# Altium schematic sheet ADR1399_BURN-IN_TOOL.SchDoc
size A4; SheetNumber: 1; SheetTotal: 1
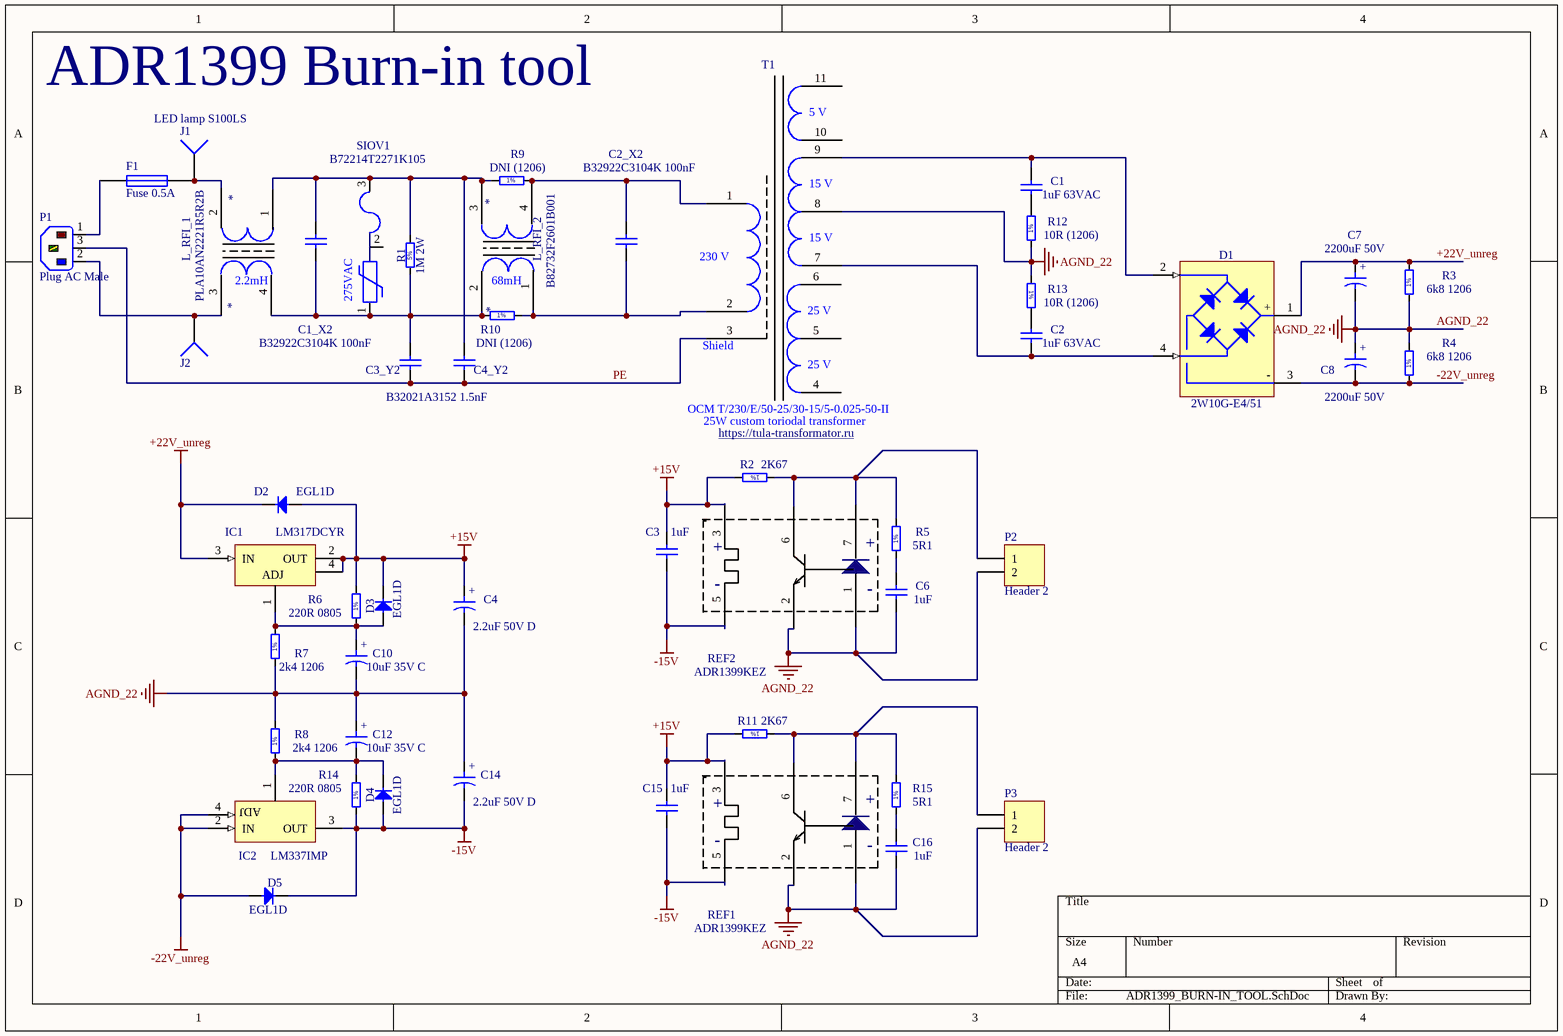
[diagram p0: ADR1399_BURN-IN_TOOL.SchDoc]

## Parts
C1  1uF 63VAC  [B32522C1105]
C1_X2  B32922C3104K 100nF  [B32922D3334K]
C2  1uF 63VAC  [B32522C1105]
C2_X2  B32922C3104K 100nF  [B32922D3334K]
C3  1uF  [C0805(2013)]
C3_Y2  B32021A3152 1.5nF  [B32021A3152]
C4  2.2uF 50V D  [CAPMP7343X310N]
C4_Y2  B32021A3152 1.5nF  [B32021A3152]  (value not drawn)
C6  1uF  [C0805(2013)]
C7  2200uF 50V  [CAPPR750-1850X3750]
C8  2200uF 50V  [CAPPR750-1850X3750]
C10  10uF 35V C  [CAPMP6032X280N]
C12  10uF 35V C  [CAPMP6032X280N]
C14  2.2uF 50V D  [CAPMP7343X310N]
C15  1uF  [C0805(2013)]
C16  1uF  [C0805(2013)]
D1  2W10G-E4/51  [VISHAY_WOG]
D2  EGL1D  [DIOMELF3515N]
D3  EGL1D  [DIOMELF3515N]
D4  EGL1D  [DIOMELF3515N]
D5  EGL1D  [DIOMELF3515N]
F1  Fuse 0.5A  [FUSE]
IC1  LM317DCYR  [SOT230P700X180-4N]
IC2  LM337IMP  [SOT230P700X180-4N]
J1  Socket  [PIN1]  (value not drawn)
J2  Socket  [PIN1]  (value not drawn)
L_RFI_1  PLA10AN2221R5R2B  [PLA10AN2221R5R2B]
L_RFI_2  B82732F2601B001  [B82732F]
P1  Plug AC Male  [AS-205]
P2  Header 2  [HDR1X2]
P3  Header 2  [HDR1X2]
R1  1M 2W  [RES_TYCO_CFR200]
R2  2K67  [R0603-1%]
R3  6k8 1206  [RESC3216X65N]
R4  6k8 1206  [RESC3216X65N]
R5  5R1  [R0603-1%]
R6  220R 0805  [RESC2012X60N]
R7  2k4 1206  [RESC3216X65N]
R8  2k4 1206  [RESC3216X65N]
R9  DNI (1206)  [RESC3216X65N]
R10  DNI (1206)  [RESC3216X65N]
R11  2K67  [R0603-1%]
R12  10R (1206)  [RESC3216X65N]
R13  10R (1206)  [RESC3216X65N]
R14  220R 0805  [RESC2012X60N]
R15  5R1  [R0603-1%]
REF1  ADR1399KEZ  [LCC-8 socket]
REF2  ADR1399KEZ  [LCC-8 socket]
SIOV1  B72214T2271K105  [B72214T2271K105]
T1  OCM T/230/E/50-25/30-15/5-0.025-50-II  [OCM T/230/E/50-25/30-15/5-0.025-50-II]  (value not drawn)

## Nets
+15V: C3.2 C4.1 C15.2 D2.2(A) D3.1(C) IC1.2(OUT) IC1.4(OUT) R2.2 R6.2 R11.2 REF1.3 REF2.3
+22V_unreg: C7.1 D1.1(+) D2.1(C) IC1.3(IN) R3.2
-15V: C3.1 C14.2 C15.1 D4.2(A) D5.1(C) IC2.3(OUT) R14.1 REF1.5 REF2.5
-22V_unreg: C8.2 D1.3(-) D5.2(A) IC2.2(IN) IC2.4(IN) R4.1
AGND_22: C4.2 C6.1 C7.2 C8.1 C10.2 C12.1 C14.1 C16.1 P2.2 P3.2 R3.1 R4.2 R7.1 R8.2 R12.1 R13.1 REF1.1 REF1.2 REF2.1 REF2.2 T1.8
PE: C3_Y2.1 C4_Y2.1 P1.3(E) T1.3
NetC1_1: C1.1 R12.2
NetC1_2: C1.2 D1.2(AC) T1.9
NetC1_X2_1: C1_X2.1 C3_Y2.2 L_RFI_1.4 L_RFI_2.2 R1.1 R10.1 SIOV1.1
NetC1_X2_2: C1_X2.2 C4_Y2.2 L_RFI_1.1 L_RFI_2.3 R1.2 R9.1 SIOV1.3
NetC2_1: C2.1 D1.4(AC) T1.7
NetC2_2: C2.2 R13.2
NetC2_X2_1: C2_X2.1 L_RFI_2.1 R10.2 T1.2
NetC2_X2_2: C2_X2.2 L_RFI_2.4 R9.2 T1.1
NetC6_2: C6.2 R5.1
NetC10_1: C10.1 D3.2(A) IC1.1(ADJ) R6.1 R7.2
NetC12_2: C12.2 D4.1(C) IC2.1(ADJ) R8.1 R14.2
NetC16_2: C16.2 R15.1
NetF1_1: F1.1 P1.1(L)
NetF1_2: F1.2 J1.1 L_RFI_1.2
NetJ2_1: J2.1 L_RFI_1.3 P1.2(N)
NetP2_1: P2.1 R2.1 R5.2 REF2.6 REF2.7
NetP3_1: P3.1 R11.1 R15.2 REF1.6 REF1.7

Not connected (* = marked no-connect by the designer): SIOV1 2; T1 4 5 6 10(5) 11

## Notes on the sheet
- ADR1399 Burn-in tool
- (near J1) LED lamp S100LS
- (near L_RFI_1) 2.2mH
- (near SIOV1) 275VAC
- (near L_RFI_2) 68mH
- (in symbol ADR1399KEZ) +; -
- (in symbol CAER_10000UF_16V_20%_CHEMI-CON_EKYB160ELL103MMP1S) +
- (in symbol CTE6032-28_10UF_25V_10%_LESR0500) +
- (in symbol CTE7343-31_22UF_35V_20%_LESR0400) +
- (in symbol OCM T/230/E/50-25/30-15/5-0.025-50-II) 5 V; 15 V; 230 V; 25 V; Shield; 25W custom toriodal transformer; https://tula-transformator.ru
- (in symbol R0805_220R_1%_0.125W_100PPM) 1%
- (in symbol R1206_2K4_1%_0.25W_100PPM) 1%
- (in symbol R1206_5R6_1%_0.25W_200PPM) 1%
- (in symbol RCF_NO-VALUE_5%_2W_0-450PPM_TYCO_CFR200) 5%

## Library data of the parts
C1 C2 = CPPR_330NF_630V_5%_2250-1050X2650X1650: Non-polarised capacitor; Part Description: Metallized Polypropylene Film Capacitor (MKP); Manufacturer: TDK; Manufacturer Part Number: B32653A6334J000; Voltage: 630VDC/250VAC; Tolerance: ±5%; Part Number: CPPR_330NF_630V_5%_2250-1050X2650X1650; Component Kind: Standard; Component Type: Standard; Footprint: CAPR2250-1050X2650X1650; Pin Count: 2; Value: 1uF 63VAC; Status: None; Case: LS22.5 W10.5 x L26.5 x H16.5; Mounted: Yes; Socket: No; SMD: No; Sense: No; ComponentHeight: 16.5mm; HelpURL: \\cern.ch\dfs\Applications\Altium\Datasheets\CPPR_TDK_B32653.pdf; Author: CERN DEM JLC; CreateDate: 20.12.2007; LatestRevisionDate: 22.04.2015
C1_X2 C2_X2 C3_Y2 C4_Y2 = CPPR_330NF_630V_5%_2250-1050X2650X1650: Non-polarised capacitor; Part Description: Metallized Polypropylene Film Capacitor (MKP); Manufacturer: TDK; Manufacturer Part Number: B32653A6334J000; Value: 330nF; Voltage: 630VDC/250VAC; Tolerance: ±5%; Part Number: CPPR_330NF_630V_5%_2250-1050X2650X1650; Component Kind: Standard; Component Type: Standard; Footprint: CAPR2250-1050X2650X1650; Pin Count: 2; Status: None; Case: LS22.5 W10.5 x L26.5 x H16.5; Mounted: Yes; Socket: No; SMD: No; Sense: No; ComponentHeight: 16.5mm; HelpURL: \\cern.ch\dfs\Applications\Altium\Datasheets\CPPR_TDK_B32653.pdf; Author: CERN DEM JLC; CreateDate: 20.12.2007; LatestRevisionDate: 22.04.2015
C3 C6 C15 C16 = CC1206_1UF_25V_10%_X7R: Non-polarised capacitor; Part Description: SMD Multilayer Chip Ceramic Capacitor; Manufacturer: GENERIC; Manufacturer1 Part Number: C1206C105K3RAC; Voltage: 25V; TC: X7R; Tolerance: ±10%; Part Number: CC1206_1UF_25V_10%_X7R; Component Kind: Standard; Component Type: Standard; Footprint: CAPC3216X140N; Pin Count: 2; Value: 1uF; Status: Preferred; Manufacturer Part Number: CC1206_1UF_25V_10%_X7R; Case: 1206; Mounted: Yes; Socket: No; SMD: Yes; Sense: No; Manufacturer1 Example: KEMET; Manufacturer1 ComponentHeight: 1.75mm; HelpURL: \\cern.ch\dfs\Applications\Altium\Datasheets\CC1206_X7R_KEMET.pdf; Author: CERN DEM JLC; CreateDate: 03.12.2007; LatestRevisionDate: 03.12.2007
C4 C14 = CTE7343-31_22UF_35V_20%_LESR0400: Polarised capacitor; Part Description: Low ESR 0R4 Solid Tantalum Chip Capacitor; Manufacturer: GENERIC; Manufacturer1 Part Number: TPSD226M035R0400; Voltage: 35V; Tolerance: ±20%; Part Number: CTE7343-31_22UF_35V_20%_LESR0400; Component Kind: Standard; Component Type: Standard; Pin Count: 2; Value: 2.2uF 50V D; Status: None; Manufacturer Part Number: CTE7343-31_22UF_35V_20%_LESR0400; Case: D; Mounted: Yes; Socket: No; SMD: Yes; Sense: No; Manufacturer1 Example: AVX; Manufacturer1 ComponentHeight: 3.1mm; HelpURL: \\cern.ch\dfs\Applications\Altium\Datasheets\CTE-LESR_AVX_TPS.pdf; Author: CERN DEM MR; CreateDate: 19.05.2016; LatestRevisionDate: 19.05.2016
C7 C8 = CAER_10000UF_16V_20%_CHEMI-CON_EKYB160ELL103MMP1S: Polarised capacitor; Part Description: Z=0R012 Miniature Aluminium Electrolytic Capacitor; Manufacturer: UNITED CHEMI-CON; Voltage: 16V; Tolerance: ±20%; Part Number: CAER_10000UF_16V_20%_CHEMI-CON_EKYB160ELL103MMP1S; Component Kind: Standard; Component Type: Standard; Pin Count: 2; Value: 2200uF 50V; Status: None; Manufacturer Part Number: EKYB160ELL103MMP1S; Case: LS7.5 D18 x H35.5; Mounted: Yes; Socket: No; SMD: No; Sense: Yes; ComponentHeight: 37mm; HelpURL: \\cern.ch\dfs\Applications\Altium\Datasheets\CAER_CHEMI-CON_KYB.pdf; Author: CERN DEM JLC; CreateDate: 02.06.2015; LatestRevisionDate: 02.06.2015
C10 C12 = CTE6032-28_10UF_25V_10%_LESR0500: Polarised capacitor; Part Description: Low ESR 0R5 Solid Tantalum Chip Capacitor; Manufacturer: GENERIC; Manufacturer1 Part Number: TPSC106K025R0500; Voltage: 25V; Tolerance: ±10%; Part Number: CTE6032-28_10UF_25V_10%_LESR0500; Component Kind: Standard; Component Type: Standard; Pin Count: 2; Value: 10uF 35V C; Status: Preferred; Manufacturer Part Number: CTE6032-28_10UF_25V_10%_LESR0500; Case: C; Mounted: Yes; Socket: No; SMD: Yes; Sense: No; Manufacturer1 Example: AVX; Manufacturer1 ComponentHeight: 2.8mm; HelpURL: \\cern.ch\dfs\Applications\Altium\Datasheets\CTE-LESR_AVX_TPS.pdf; Author: CERN DEM JLC; CreateDate: 05.05.2008; LatestRevisionDate: 20.01.2009
D1 = W005G-E4/51: Bridge Rectifier 1+ 2AC 3- 4AC; Part Description: Glass Passivated Single-Phase Bridge Rectifier; Manufacturer: VISHAY GENERAL SEMICONDUCTOR; Voltage: 50V; Power: 1.5A; PressFit: No; Bonding: No; Part Number: W005G-E4/51; Component Kind: Standard; Component Type: Standard; Device: 2W10G-E4/51; PackageDescription: Bridge Rectifier, Body 9.35m x 8.33mm, VISHAY Case Type WOG; Manufacturer Part Number: W005G-E4/51; Pin Count: 4; Mounted: Yes; Socket: No; SMD: No; Sense: No; ComponentHeight: 13.5mm; HelpURL: \\cern.ch\dfs\Applications\Altium\Datasheets\W005G-E4-51.pdf; Author: CERN DEM JLC; CreateDate: 20.09.2011; LatestRevisionDate: 08.04.2016
D2-D5 = PMLL4148L: Diode; Part Description: High-speed switching diodes; Manufacturer: NXP SEMICONDUCTORS; Voltage: 75V; Power: 200mA; PressFit: No; Bonding: No; Part Number: PMLL4148L; Component Kind: Standard; Component Type: Standard; Device: EGL1D; PackageDescription: SOD80C, MELF Diode, 2-Leads, Body 3.5x1.5mm, IPC Medium Density; Status: Not recommended; Manufacturer Part Number: PMLL4148L; Pin Count: 2; Case: SOD-80C; Mounted: Yes; Socket: No; SMD: Yes; Sense: No; ComponentHeight: 1.6mm; HelpURL: \\cern.ch\dfs\Applications\Altium\Datasheets\PMLL4148L.pdf; Author: CERN DEM JLC; CreateDate: 30.03.2009; LatestRevisionDate: 09.12.2009
F1 = Fuse 1: Fuse; Published: 8-Jun-2000; LatestRevisionDate: 17-Jul-2002; LatestRevisionNote: Re-released for DXP Platform.; PackageReference: PIN-W2/E2.8; Publisher: Altium Limited; PackageDescription: Thru-Hole; 2 Leads
IC1 = LM317EMP: 3-Terminal Regulator 1=Adj 2=OUT 3=IN 4=OUT; Part Description: 3-Terminal 1.2V To 37V 1A Positive Adjustable Regulator; Manufacturer: TEXAS INSTRUMENTS; PressFit: No; Bonding: No; Part Number: LM317EMP; Component Kind: Standard; Component Type: Standard; Device: LM317DCYR; PackageDescription: SOT223, 2.30mm pitch; 3 pin, 3.70mm W X 6.70mm L, IPC Medium Density; Status: Not Recommended; Manufacturer Part Number: LM317EMP; Pin Count: 4; Case: SOT-223; Mounted: Yes; Socket: No; SMD: Yes; Sense: No; ComponentHeight: 1.8mm; HelpURL: \\cern.ch\dfs\Applications\Altium\Datasheets\LM317EMP.pdf; Author: CERN DEM JLC; CreateDate: 02.12.2008; LatestRevisionDate: 16.09.2014
IC2 = LM337IMP/NOPB: 3-Terminal Regulator 1=Adj 2=IN 3=OUT 4=IN; Part Description: 3-Terminal -1.2V To -37V 1A Adjustable Negative Regulator; Manufacturer: TEXAS INSTRUMENTS; PressFit: No; Bonding: No; Part Number: LM337IMP/NOPB; Component Kind: Standard; Component Type: Standard; Device: LM337IMP; PackageDescription: SOT223, 2.30mm pitch; 3 pin, 3.70mm W X 6.70mm L, IPC Medium Density; Manufacturer Part Number: LM337IMP/NOPB; Pin Count: 4; Case: SOT-223; Mounted: Yes; Socket: No; SMD: Yes; Sense: No; ComponentHeight: 1.8mm; HelpURL: \\cern.ch\dfs\Applications\Altium\Datasheets\LM337IMP-NOPB.pdf; Author: CERN DEM JLC; CreateDate: 31.08.2010; LatestRevisionDate: 21.09.2015
L_RFI_2 = PLA10AN2221R5R2B
P1 = Plug AC Male: IEC Mains Power Inlet, EN60 320-1 C14 Class I Cold Condition, PC Flange Rear Mount, Chassis Plug; PackageDocument: ver.80, 15-Sep-2003; MaximumRating: 10A, 250V a.c. (UL & CSA 15A, 250V a.c.); MountingFixtures: Not drawn on schematic symbol.; PCB_Layout: Complies with manufacturer's recommendation.; DrillSize: Corresponds to nominal value.; Note: IEC Color Scheme employed for L, N and E.; Published: 15-Jul-2004; LatestRevisionDate: 15-Jul-2004; LatestRevisionNote: Component Replaced.; DatasheetDocument: ver.80, 15-Sep-2003; PackageReference: PX0580/PC; Publisher: Altium Limited; Terminations: P.C. Spills; ComponentLink1Description: Manufacturer Link; ComponentLink1URL: http://www.bulgin.co.uk/
P2 P3 = Header 2: Header, 2-Pin; LatestRevisionDate: 17-Jul-2002; LatestRevisionNote: Re-released for DXP Platform.; Publisher: Altium Limited
R1 = RCF_NO-VALUE_5%_2W_0-450PPM_TYCO_CFR200: Resistor - 5%; Part Description: Carbon Film Fixed Resistor - CFR  Series; Manufacturer: TYCO ELECTRONICS; Manufacturer Part Number: CFR200J; TC: 0 -450ppm/°C; PressFit: No; Mounted: No; Part Number: RCF_NO-VALUE_5%_2W_0-450PPM_TYCO_CFR200; Component Kind: Standard; Component Type: Standard; Pin Count: 2; Value: 1M 2W; Status: None; Power: 2W; Tolerance: ±5%; Case: LS20.32 L16 x D5.5; Sense: No; Socket: No; SMD: No; ComponentHeight: 5.5mm; HelpURL: \\cern.ch\dfs\Applications\Altium\Datasheets\RCF_TYCO_CFR200.pdf; Author: CERN DEM JLC; CreateDate: 10.03.2014; LatestRevisionDate: 03.06.2014
R2 R5 R11 R15 = R1206_5R6_1%_0.25W_200PPM: Resistor - 1%; Part Description: General Purpose Thick Film Chip Resistor; Manufacturer: GENERIC; Manufacturer1 Part Number: 232272465608L or RC1206FR-075R6L; Power: 0.25W; TC: ±200ppm/°C; PressFit: No; Part Number: R1206_5R6_1%_0.25W_200PPM; Component Kind: Standard; Component Type: Standard; Footprint: RESC3216X65N; Pin Count: 2; Status: Preferred; Tolerance: ±1%; Manufacturer Part Number: R1206_5R6_1%_0.25W_200PPM; Case: 1206; Mounted: Yes; Sense: No; Socket: No; SMD: Yes; Manufacturer1 Example: YAGEO PHYCOMP; Manufacturer1 ComponentHeight: 0.65mm; HelpURL: \\cern.ch\dfs\Applications\Altium\Datasheets\R1206_Phycomp_RC1206.pdf; Author: CERN DEM JLC; CreateDate: 24.06.2009; LatestRevisionDate: 17.10.2012
  R2 R11: Value: 2K67
  R5 R15: Value: 5R1
R3 R4 R7-R10 R12 R13 = R1206_2K4_1%_0.25W_100PPM: Resistor - 1%; Part Description: General Purpose Thick Film Chip Resistor; Manufacturer: GENERIC; Manufacturer1 Part Number: NRC12F2401TRF; Power: 0.25W; TC: ±100ppm/°C; PressFit: No; Part Number: R1206_2K4_1%_0.25W_100PPM; Component Kind: Standard; Component Type: Standard; Pin Count: 2; Status: Preferred; Tolerance: ±1%; Manufacturer Part Number: R1206_2K4_1%_0.25W_100PPM; Case: 1206; Mounted: Yes; Sense: No; Socket: No; SMD: Yes; Manufacturer1 Example: NIC COMPONENT; Manufacturer1 ComponentHeight: 0.65mm; HelpURL: \\cern.ch\dfs\Applications\Altium\Datasheets\R1206_NIC_NRC.pdf; Author: CERN DEM JLC; CreateDate: 03.12.2007; LatestRevisionDate: 13.03.2008
  R3 R4: Value: 6k8 1206
  R7 R8: Value: 2k4 1206
  R9 R10: Value: DNI (1206)
  R12 R13: Value: 10R (1206)
R6 R14 = R0805_220R_1%_0.125W_100PPM: Resistor - 1%; Part Description: General Purpose Thick Film Chip Resistor; Manufacturer: GENERIC; Manufacturer1 Part Number: NRC10F2200TRF; Power: 0.125W; TC: ±100ppm/°C; PressFit: No; Part Number: R0805_220R_1%_0.125W_100PPM; Component Kind: Standard; Component Type: Standard; Pin Count: 2; Value: 220R 0805; Status: Preferred; Tolerance: ±1%; Manufacturer Part Number: R0805_220R_1%_0.125W_100PPM; Case: 0805; Mounted: Yes; Sense: No; Socket: No; SMD: Yes; Manufacturer1 Example: NIC COMPONENT; Manufacturer1 ComponentHeight: 0.6mm; HelpURL: \\cern.ch\dfs\Applications\Altium\Datasheets\R0805_NIC_NRC.pdf; Author: CERN DEM JLC; CreateDate: 03.12.2007; LatestRevisionDate: 13.03.2008
J1 J2 = Socket: LatestRevisionDate: 17-Jul-2002; LatestRevisionNote: Re-released for DXP Platform.; Publisher: Altium Limited
SIOV1 = B72214T2271K105: Published: 8-Jun-2000; LatestRevisionDate: 29-May-2009; LatestRevisionNote: IPC-7351 Footprint Added.; PackageReference: J1-0603; Publisher: Altium Limited; PackageDescription: Chip Resistor; Order: B72214T2271K105